# Altium schematic sheet Ethernet2.SchDoc
size A4; DocumentNumber: 17; SheetNumber: 17; SheetTotal: 47
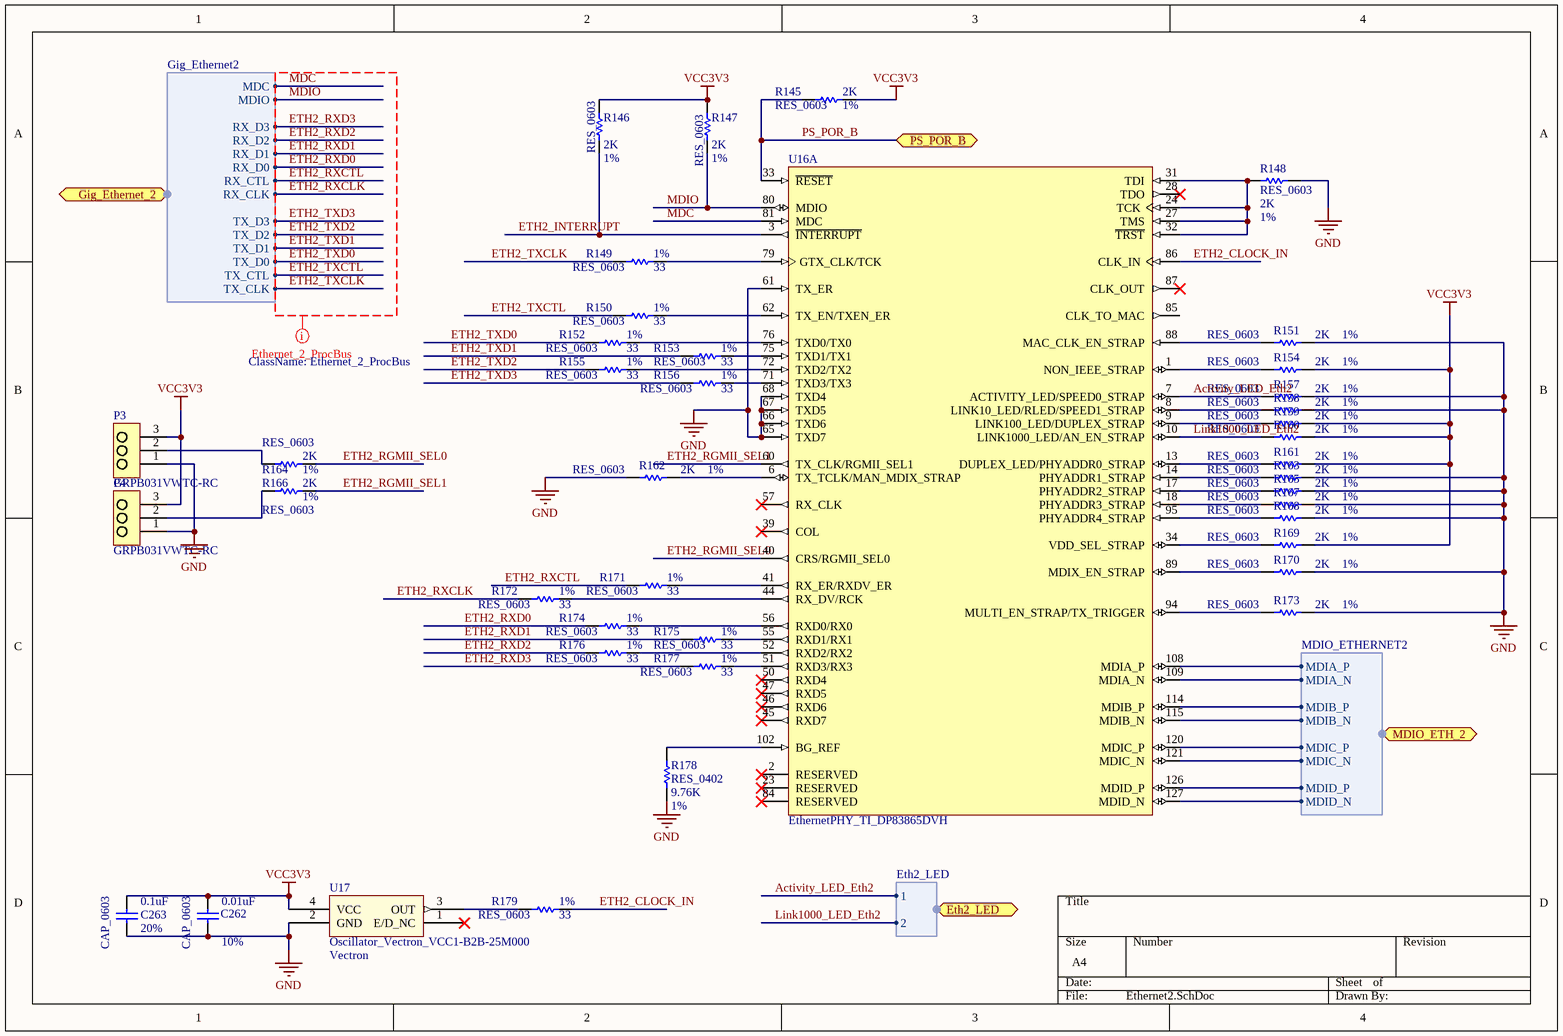
[diagram p0: Ethernet2.SchDoc]

## Parts
C262  CAP_0603  value 0.01uF  Tolerance: 10%  [CAPC0603(1608)100_N]
C263  CAP_0603  value 0.1uF  Tolerance: 20%  [CAPC0603(1608)100_N]
P3  GRPB031VWTC-RC  [Header_3-Pos_Sullins_GRPB031VWTC-RC]
P4  GRPB031VWTC-RC  [Header_3-Pos_Sullins_GRPB031VWTC-RC]
R145  RES_0603  value 2K  Tolerance: 1%  [RESC0603(1608)_N]
R146  RES_0603  value 2K  Tolerance: 1%  [RESC0603(1608)_N]
R147  RES_0603  value 2K  Tolerance: 1%  [RESC0603(1608)_N]
R148  RES_0603  value 2K  Tolerance: 1%  [RESC0603(1608)_N]
R149  RES_0603  value 33  Tolerance: 1%  [RESC0603(1608)_N]
R150  RES_0603  value 33  Tolerance: 1%  [RESC0603(1608)_N]
R151  RES_0603  value 2K  Tolerance: 1%  [RESC0603(1608)_N]
R152  RES_0603  value 33  Tolerance: 1%  [RESC0603(1608)_N]
R153  RES_0603  value 33  Tolerance: 1%  [RESC0603(1608)_N]
R154  RES_0603  value 2K  Tolerance: 1%  [RESC0603(1608)_N]
R155  RES_0603  value 33  Tolerance: 1%  [RESC0603(1608)_N]
R156  RES_0603  value 33  Tolerance: 1%  [RESC0603(1608)_N]
R157  RES_0603  value 2K  Tolerance: 1%  [RESC0603(1608)_N]
R158  RES_0603  value 2K  Tolerance: 1%  [RESC0603(1608)_N]
R159  RES_0603  value 2K  Tolerance: 1%  [RESC0603(1608)_N]
R160  RES_0603  value 2K  Tolerance: 1%  [RESC0603(1608)_N]
R161  RES_0603  value 2K  Tolerance: 1%  [RESC0603(1608)_N]
R162  RES_0603  value 2K  Tolerance: 1%  [RESC0603(1608)_N]
R163  RES_0603  value 2K  Tolerance: 1%  [RESC0603(1608)_N]
R164  RES_0603  value 2K  Tolerance: 1%  [RESC0603(1608)_N]
R165  RES_0603  value 2K  Tolerance: 1%  [RESC0603(1608)_N]
R166  RES_0603  value 2K  Tolerance: 1%  [RESC0603(1608)_N]
R167  RES_0603  value 2K  Tolerance: 1%  [RESC0603(1608)_N]
R168  RES_0603  value 2K  Tolerance: 1%  [RESC0603(1608)_N]
R169  RES_0603  value 2K  Tolerance: 1%  [RESC0603(1608)_N]
R170  RES_0603  value 2K  Tolerance: 1%  [RESC0603(1608)_N]
R171  RES_0603  value 33  Tolerance: 1%  [RESC0603(1608)_N]
R172  RES_0603  value 33  Tolerance: 1%  [RESC0603(1608)_N]
R173  RES_0603  value 2K  Tolerance: 1%  [RESC0603(1608)_N]
R174  RES_0603  value 33  Tolerance: 1%  [RESC0603(1608)_N]
R175  RES_0603  value 33  Tolerance: 1%  [RESC0603(1608)_N]
R176  RES_0603  value 33  Tolerance: 1%  [RESC0603(1608)_N]
R177  RES_0603  value 33  Tolerance: 1%  [RESC0603(1608)_N]
R178  RES_0402  value 9.76K  Tolerance: 1%  [RESC0402(1005)_N]
R179  RES_0603  value 33  Tolerance: 1%  [RESC0603(1608)_N]
U16  EthernetPHY_TI_DP83865DVH  [EthernetPHY_TI_DP83865(PQFP)_VLA128A_N]  (part A of 2)
U17  Oscillator_Vectron_VCC1-B2B-25M000  Manufacturer: Vectron  [Oscillator_Vectron_VCC1-B2B-25M000_SMD]

## Ports
Eth2_LED (harness Eth2_LED), Gig_Ethernet_2 (harness Gig_Ethernet2), MDIO_ETH_2 (harness MDIO_ETHERNET2), PS_POR_B (bidir)

## Harnesses
MDIO_ETHERNET2: MDIA_P, MDIA_N, MDIB_P, MDIB_N, MDIC_P, MDIC_N, MDID_P, MDID_N
Gig_Ethernet2: TX_CLK, TX_CTL, TX_D0, TX_D1, TX_D2, TX_D3, RX_D0, RX_D1, RX_D2, RX_D3, RX_CLK, RX_CTL, MDIO, MDC
Eth2_LED: 1, 2

## Nets
GND: C262.1 C263.2 P3.1 P4.1 R148.1 R151.1 R157.1 R158.1 R162.2 R163.1 R165.1 R167.1 R168.1 R170.1 R173.1 R178.1 U16.61(TX_ER) U16.65(TXD7) U16.66(TXD6) U16.67(TXD5) U16.68(TXD4) U17.2(GND)
VCC3V3: C262.2 C263.1 P3.3 P4.3 R145.1 R146.2 R147.2 R154.1 R159.1 R160.1 R161.1 R169.1 U17.4(VCC)
Activity_LED_Eth2: R157.2 U16.7(ACTIVITY_LED/SPEED0_STRAP) ; port Eth2_LED.1
ETH2_CLOCK_IN: R179.2 U16.86(CLK_IN)
ETH2_INTERRUPT: R146.1 U16.3(~{INTERRUPT})
ETH2_RGMII_SEL0: R164.1 U16.40(CRS/RGMII_SEL0)
ETH2_RGMII_SEL1: R166.1 U16.60(TX_CLK/RGMII_SEL1)
ETH2_RXCLK: R172.1 ; port Gig_Ethernet_2.RX_CLK
ETH2_RXCTL: R171.1 ; port Gig_Ethernet_2.RX_CTL
ETH2_RXD0: R174.1 ; port Gig_Ethernet_2.RX_D0
ETH2_RXD1: R175.1 ; port Gig_Ethernet_2.RX_D1
ETH2_RXD2: R176.1 ; port Gig_Ethernet_2.RX_D2
ETH2_RXD3: R177.1 ; port Gig_Ethernet_2.RX_D3
ETH2_TXCLK: R149.1 ; port Gig_Ethernet_2.TX_CLK
ETH2_TXCTL: R150.1 ; port Gig_Ethernet_2.TX_CTL
ETH2_TXD0: R152.1 ; port Gig_Ethernet_2.TX_D0
ETH2_TXD1: R153.1 ; port Gig_Ethernet_2.TX_D1
ETH2_TXD2: R155.1 ; port Gig_Ethernet_2.TX_D2
ETH2_TXD3: R156.1 ; port Gig_Ethernet_2.TX_D3
Link1000_LED_Eth2: R160.2 U16.10(LINK1000_LED/AN_EN_STRAP) ; port Eth2_LED.2
MDC: U16.81(MDC) ; port Gig_Ethernet_2.MDC
MDIO: R147.1 U16.80(MDIO) ; port Gig_Ethernet_2.MDIO
PS_POR_B: R145.2 U16.33(~{RESET}) ; port PS_POR_B
NetP3_2: P3.2 R164.2
NetP4_2: P4.2 R166.2
NetR148_2: R148.2 U16.24(TCK) U16.27(TMS) U16.31(TDI) U16.32(~{TRST})
NetR149_2: R149.2 U16.79(GTX_CLK/TCK)
NetR150_2: R150.2 U16.62(TX_EN/TXEN_ER)
NetR151_2: R151.2 U16.88(MAC_CLK_EN_STRAP)
NetR152_2: R152.2 U16.76(TXD0/TX0)
NetR153_2: R153.2 U16.75(TXD1/TX1)
NetR154_2: R154.2 U16.1(NON_IEEE_STRAP)
NetR155_2: R155.2 U16.72(TXD2/TX2)
NetR156_2: R156.2 U16.71(TXD3/TX3)
NetR158_2: R158.2 U16.8(LINK10_LED/RLED/SPEED1_STRAP)
NetR159_2: R159.2 U16.9(LINK100_LED/DUPLEX_STRAP)
NetR161_2: R161.2 U16.13(DUPLEX_LED/PHYADDR0_STRAP)
NetR162_1: R162.1 U16.6(TX_TCLK/MAN_MDIX_STRAP)
NetR163_2: R163.2 U16.14(PHYADDR1_STRAP)
NetR165_2: R165.2 U16.17(PHYADDR2_STRAP)
NetR167_2: R167.2 U16.18(PHYADDR3_STRAP)
NetR168_2: R168.2 U16.95(PHYADDR4_STRAP)
NetR169_2: R169.2 U16.34(VDD_SEL_STRAP)
NetR170_2: R170.2 U16.89(MDIX_EN_STRAP)
NetR171_2: R171.2 U16.41(RX_ER/RXDV_ER)
NetR172_2: R172.2 U16.44(RX_DV/RCK)
NetR173_2: R173.2 U16.94(MULTI_EN_STRAP/TX_TRIGGER)
NetR174_2: R174.2 U16.56(RXD0/RX0)
NetR175_2: R175.2 U16.55(RXD1/RX1)
NetR176_2: R176.2 U16.52(RXD2/RX2)
NetR177_2: R177.2 U16.51(RXD3/RX3)
NetR178_2: R178.2 U16.102(BG_REF)
NetR179_1: R179.1 U17.3(OUT)
NetU16_108: U16.108(MDIA_P) ; port MDIO_ETH_2.MDIA_P
NetU16_109: U16.109(MDIA_N) ; port MDIO_ETH_2.MDIA_N
NetU16_114: U16.114(MDIB_P) ; port MDIO_ETH_2.MDIB_P
NetU16_115: U16.115(MDIB_N) ; port MDIO_ETH_2.MDIB_N
NetU16_120: U16.120(MDIC_P) ; port MDIO_ETH_2.MDIC_P
NetU16_121: U16.121(MDIC_N) ; port MDIO_ETH_2.MDIC_N
NetU16_126: U16.126(MDID_P) ; port MDIO_ETH_2.MDID_P
NetU16_127: U16.127(MDID_N) ; port MDIO_ETH_2.MDID_N

Not connected (* = marked no-connect by the designer): U16 2(RESERVED)* 23(RESERVED)* 28(TDO)* 39(COL)* 45(RXD7)* 46(RXD6)* 47(RXD5)* 50(RXD4)* 57(RX_CLK)* 84(RESERVED)* 85(CLK_TO_MAC) 87(CLK_OUT)*; U17 1(E/D_NC)*

## Layout directives
net class Ethernet_2_ProcBus: ETH2_RXCLK, ETH2_RXCTL, ETH2_RXD0, ETH2_RXD1, ETH2_RXD2, ETH2_RXD3, ETH2_TXCLK, ETH2_TXCTL, ETH2_TXD0, ETH2_TXD1, ETH2_TXD2, ETH2_TXD3, MDC, MDIO

## Library data of the parts
C262 = C0603C103K9RACTU: CAP CER 10000PF 6.3V X7R 0603; Manufacturer: Kemet; Part Number: C0603C103K9RACTU; Footprint Ref: CAPC0603(1608)100_N; Library Ref: CAP_0603
C263 = 6R3X14W104MV4T: CAP CER 0.1UF 6.3V 20% X7R 0603; Manufacturer: Johanson Dielectrics Inc; Part Number: 6R3X14W104MV4T; Footprint Ref: CAPC0603(1608)100_N; Library Ref: CAP_0603
P3 P4 = GRPB031VWTC-RC: CONN HEADER .050" 3POS SMD GOLD; Manufacturer: Sullins Connector Solutions; Part Number: GRPB031VWTC-RC
R145-R148 R151 R154 R157-R170 R173 = ERJ-3EKF2001V: RES 2.00K OHM 1/10W 1% 0603 SMD; Manufacturer: Panasonic Electronics Components; Part Number: ERJ-3EKF2001V; Footprint Ref: RESC0603(1608)_N; Library Ref: RES_0603
R149 R150 R152 R153 R155 R156 R171 R172 R174-R177 R179 = ERJ-3EKF33R0V: RES 33.0 OHM 1/10W 1% 0603 SMD; Manufacturer: Panasonic Electronics Components; Part Number: ERJ-3EKF33R0V; Footprint Ref: RESC0603(1608)_N; Library Ref: RES_0603
R178 = CRCW04029K76FKED: 9.76K ohm, 1% 1/16W, 0402; Manufacturer: Vishay/Dale; Part Number: CRCW04029K76FKED; Footprint Ref: RESC0402(1005)_N; Library Ref: RES_0402
U16 = DP83865DVH: Ethernet PHY_TI_DP83865DVH, Gigabit Ethernet PHYTER,128 Lead Plastic Flat Pack; Manufacturer: Texas Instruments; Part Number: DP83865DVH
U17 = VCC1-B2B-25M000: VCC1-B2B-25M000, 25MHz, 3.3V +/- 10%, No tri-state, +/-50 ppm, -40 to +85 deg; Part Number: VCC1-B2B-25M000; Footprint Ref: Oscillator_Vectron_VCC1-B2B-25M000_SMD; Library Ref: Oscillator_Vectron_VCC1-B2B-25M000